# Altium schematic sheet FIT_TCM_SN65LVDT100.SchDoc
size A4; SheetNumber: 8; SheetTotal: 29
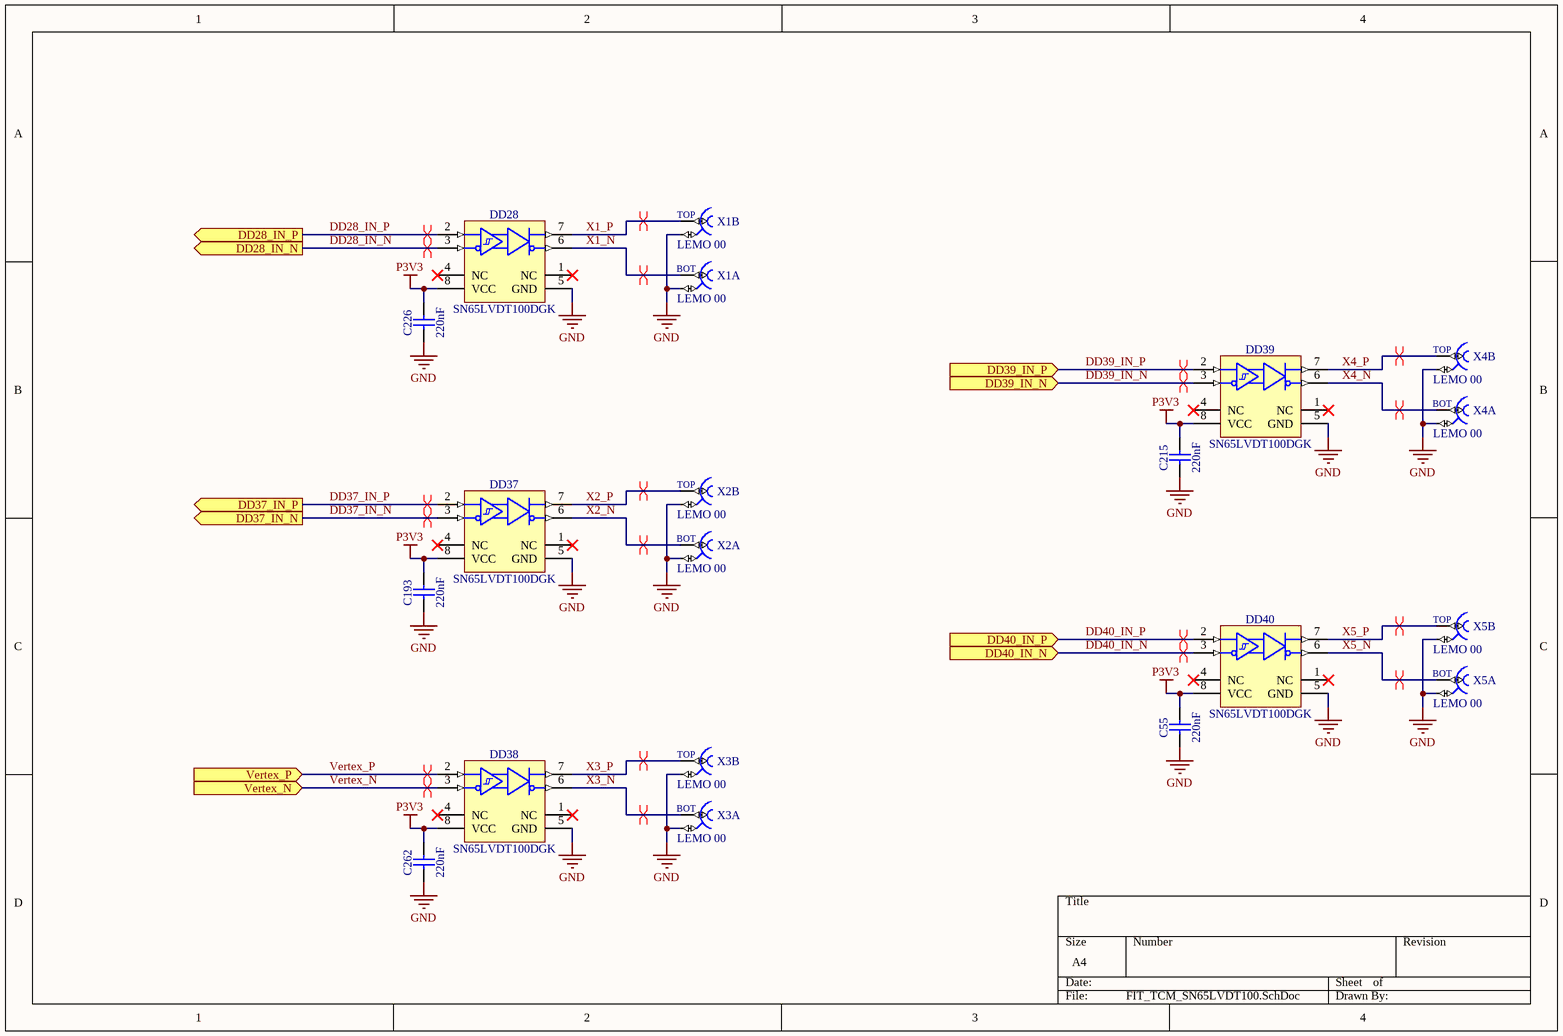
[diagram p0: FIT_TCM_SN65LVDT100.SchDoc]

## Parts
C55  220nF  [CAPC2012X135N]
C193  220nF  [CAPC2012X135N]
C215  220nF  [CAPC2012X135N]
C226  220nF  [CAPC2012X135N]
C262  220nF  [CAPC2012X135N]
DD28  SN65LVDT100DGK  [SOP65P490X110-8N]
DD37  SN65LVDT100DGK  [SOP65P490X110-8N]
DD38  SN65LVDT100DGK  [SOP65P490X110-8N]
DD39  SN65LVDT100DGK  [SOP65P490X110-8N]
DD40  SN65LVDT100DGK  [SOP65P490X110-8N]
X1  LEMO 00  [LEMO_EPY.00.250.NTN]  (parts A,B of 2)
X2  LEMO 00  [LEMO_EPY.00.250.NTN]  (parts A,B of 2)
X3  LEMO 00  [LEMO_EPY.00.250.NTN]  (parts A,B of 2)
X4  LEMO 00  [LEMO_EPY.00.250.NTN]  (parts A,B of 2)
X5  LEMO 00  [LEMO_EPY.00.250.NTN]  (parts A,B of 2)

## Ports
DD28_IN_N (out), DD28_IN_P (out), DD37_IN_N (out), DD37_IN_P (out), DD39_IN_N (in), DD39_IN_P (in), DD40_IN_N (in), DD40_IN_P (in), Vertex_N (in), Vertex_P (in)

## Nets
GND: C55.1 C193.1 C215.1 C226.1 C262.1 DD28.5(GND) DD37.5(GND) DD38.5(GND) DD39.5(GND) DD40.5(GND) X1.3 X2.3 X3.3 X4.3 X5.3
P3V3: C55.2 C193.2 C215.2 C226.2 C262.2 DD28.8(VCC) DD37.8(VCC) DD38.8(VCC) DD39.8(VCC) DD40.8(VCC)
DD28_IN_N: DD28.3(B) ; port DD28_IN_N
DD28_IN_P: DD28.2(A) ; port DD28_IN_P
DD37_IN_N: DD37.3(B) ; port DD37_IN_N
DD37_IN_P: DD37.2(A) ; port DD37_IN_P
DD39_IN_N: DD39.3(B) ; port DD39_IN_N
DD39_IN_P: DD39.2(A) ; port DD39_IN_P
DD40_IN_N: DD40.3(B) ; port DD40_IN_N
DD40_IN_P: DD40.2(A) ; port DD40_IN_P
Vertex_N: DD38.3(B) ; port Vertex_N
Vertex_P: DD38.2(A) ; port Vertex_P
X1_N: DD28.6(Z) X1.1
X1_P: DD28.7(Y) X1.2
X2_N: DD37.6(Z) X2.1
X2_P: DD37.7(Y) X2.2
X3_N: DD38.6(Z) X3.1
X3_P: DD38.7(Y) X3.2
X4_N: DD39.6(Z) X4.1
X4_P: DD39.7(Y) X4.2
X5_N: DD40.6(Z) X5.1
X5_P: DD40.7(Y) X5.2

Not connected (* = marked no-connect by the designer): DD28 1(NC)* 4(NC)*; DD37 1(NC)* 4(NC)*; DD38 1(NC)* 4(NC)*; DD39 1(NC)* 4(NC)*; DD40 1(NC)* 4(NC)*

## Layout directives
differential pair: DD28_IN_N, DD28_IN_P, DD37_IN_N, DD37_IN_P, DD39_IN_N, DD39_IN_P, DD40_IN_N, DD40_IN_P, Vertex_N, Vertex_P, X1_N, X1_P, X2_N, X2_P, X3_N, X3_P, X4_N, X4_P, X5_N, X5_P

## Notes on the sheet
- (in symbol LEMO_EPY.00.250.NTN, part A) BOT
- (in symbol LEMO_EPY.00.250.NTN, part B) TOP

## Library data of the parts
C55 C193 C215 C226 C262 = CC0805_220NF_50V_10%_X7R: Non-polarised capacitor; Part Description: SMD Multilayer Chip Ceramic Capacitor; Manufacturer: GENERIC; Manufacturer1 Part Number: GRM21BR71H224KA01L; Voltage: 50V; TC: X7R; Tolerance: ±10%; Part Number: CC0805_220NF_50V_10%_X7R; Component Kind: Standard; Component Type: Standard; Pin Count: 2; Value: 220nF; Status: Preferred; Manufacturer Part Number: CC0805_220NF_50V_10%_X7R; Case: 0805; Mounted: Yes; Socket: No; SMD: Yes; Sense: No; Manufacturer1 Example: MURATA; Manufacturer1 ComponentHeight: 1.35mm; HelpURL: \\cern.ch\dfs\Applications\Altium\Datasheets\CC0805_X7R_MURATA.pdf; Author: CERN DEM JLC; CreateDate: 03.12.2007; LatestRevisionDate: 03.12.2007
DD28 DD37-DD40 = SN65LVDT100DGK: 2Gbps LVDS/LVPECL/CML to LVDS Translator/Repeater; Manufacturer: TEXAS INSTRUMENTS; PressFit: No; Bonding: No; Part Number: SN65LVDT100DGK; Component Kind: Standard; Component Type: Standard; Device: SN65LVDT100DGK; PackageDescription: SOP, 0.65mm Pitch; 8 Pin, 3.00mm W X 3.00mm L X 1.10mm H body, IPC Medium Density; Part Description: 2Gbps LVDS/LVPECL/CML to LVDS Translator/Repeater; Manufacturer Part Number: SN65LVDT100DGK; Pin Count: 8; Case: SSOP8; Mounted: Yes; Socket: No; SMD: Yes; Sense: No; ComponentHeight: 1.1mm; Author: CERN DEM HF; HelpURL: \\cern.ch\dfs\Applications\Altium\Datasheets\SN65LVDT100D.pdf; CreateDate: 21.06.2023; LatestRevisionDate: 21.06.2023
X1-X5 = LEMO_EPY.00.250.NTN: Dual Female Coax 1-2 Common Shield 3; Part Description: Size 00, Dual 50 Ohms Coaxial Elbow Sockets (90°); PressFit: No; SCEM: 09.46.11.186.0; Part Number: LEMO_EPY.00.250.NTN; Component Kind: Standard; Component Type: Standard; Pin Count: 4; Family: LEMO 00; Mounted: Yes; Socket: No; SMD: No; Sense: No; Status: None; Manufacturer: LEMO; Manufacturer Part Number: EPY.00.250.NTN; ComponentHeight: 14.8mm; HelpURL: \\cern.ch\dfs\Applications\Altium\Datasheets\LEMO_EPY.00.250.NTN.pdf; Author: CERN DEM JMW; CreateDate: 10.12.2008; LatestRevisionDate: 11.08.2009